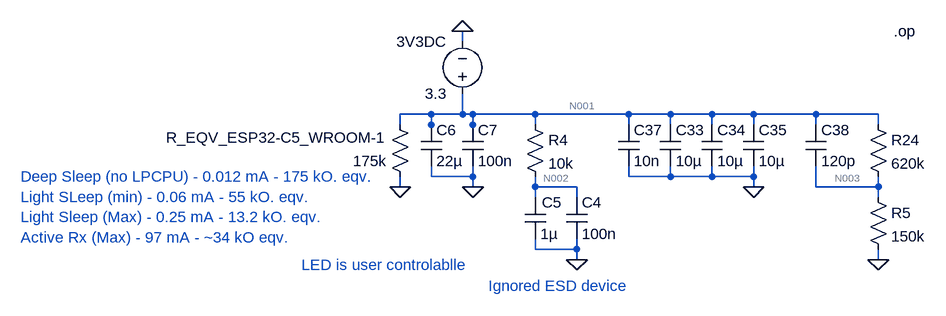
[diagram p0: schematic ESP32C5_DFR1222v1.0_FireBeetle2IoT_LTSpice.asc]
ESP32C5_DFR1222v1.0_FireBeetle2IoT_LTSpice.asc, the LTspice schematic file:
Version 4.1
SHEET 1 880 680
WIRE 144 48 144 32
WIRE 96 160 48 160
WIRE 144 160 144 128
WIRE 144 160 96 160
WIRE 160 160 144 160
WIRE 256 160 160 160
WIRE 400 160 256 160
WIRE 464 160 400 160
WIRE 528 160 464 160
WIRE 592 160 528 160
WIRE 688 160 592 160
WIRE 784 160 688 160
WIRE 48 176 48 160
WIRE 96 176 96 160
WIRE 160 176 160 160
WIRE 256 176 256 160
WIRE 400 176 400 160
WIRE 464 176 464 160
WIRE 528 176 528 160
WIRE 592 176 592 160
WIRE 688 176 688 160
WIRE 784 176 784 160
WIRE 96 192 96 176
WIRE 160 192 160 176
WIRE 96 256 96 240
WIRE 160 256 160 240
WIRE 160 256 96 256
WIRE 400 256 400 240
WIRE 464 256 464 240
WIRE 464 256 400 256
WIRE 528 256 528 240
WIRE 528 256 464 256
WIRE 592 256 592 240
WIRE 592 256 528 256
WIRE 48 272 48 256
WIRE 160 272 160 256
WIRE 256 272 256 256
WIRE 320 272 256 272
WIRE 592 272 592 256
WIRE 688 272 688 240
WIRE 784 272 784 256
WIRE 784 272 688 272
WIRE 256 288 256 272
WIRE 320 288 320 272
WIRE 784 288 784 272
WIRE 256 368 256 352
WIRE 320 368 320 352
WIRE 320 368 256 368
WIRE 320 384 320 368
WIRE 784 384 784 368
FLAG 144 32 0
FLAG 48 272 0
FLAG 160 272 0
FLAG 320 384 0
FLAG 592 272 0
FLAG 784 384 0
SYMBOL voltage 144 144 R180
WINDOW 0 24 96 Left 2
WINDOW 3 24 16 Left 2
SYMATTR InstName 3V3DC
SYMATTR Value 3.3
SYMBOL res 64 272 R180
WINDOW 0 36 76 Left 2
WINDOW 3 36 40 Left 2
SYMATTR InstName R_EQV_ESP32-C5_WROOM-1
SYMATTR Value 175k
SYMBOL cap 80 176 R0
SYMATTR InstName C6
SYMATTR Value 22µ
SYMBOL cap 144 176 R0
SYMATTR InstName C7
SYMATTR Value 100n
SYMBOL res 240 160 R0
SYMATTR InstName R4
SYMATTR Value 10k
SYMBOL cap 240 288 R0
WINDOW 0 26 8 Left 2
SYMATTR InstName C5
SYMATTR Value 1µ
SYMBOL cap 304 288 R0
SYMATTR InstName C4
SYMATTR Value 100n
SYMBOL cap 384 176 R0
SYMATTR InstName C37
SYMATTR Value 10n
SYMBOL cap 448 176 R0
SYMATTR InstName C33
SYMATTR Value 10µ
SYMBOL cap 512 176 R0
SYMATTR InstName C34
SYMATTR Value 10µ
SYMBOL cap 576 176 R0
SYMATTR InstName C35
SYMATTR Value 10µ
SYMBOL cap 672 176 R0
SYMATTR InstName C38
SYMATTR Value 120p
SYMBOL res 768 160 R0
SYMATTR InstName R24
SYMATTR Value 620k
SYMBOL res 768 272 R0
SYMATTR InstName R5
SYMATTR Value 150k
TEXT -536 256 Left 2 ;Deep Sleep (no LPCPU) - 0.012 mA - 175 kO. eqv.\nLight SLeep (min) - 0.06 mA - 55 kO. eqv.\nLight Sleep (Max) - 0.25 mA - 13.2 kO. eqv.\nActive Rx (Max) - 97 mA - ~34 kO eqv.
TEXT 184 424 Left 2 ;Ignored ESD device
TEXT -104 392 Left 2 ;LED is user controlablle
TEXT 808 32 Left 2 !.op

The netlist it stands for:
* ESP32C5_DFR1222v1.0_FireBeetle2IoT_LTSpice.asc
V§3V3DC N001 0 3.3
R_EQV_ESP32-C5_WROOM-1 0 N001 175k
C6 N001 0 22µ
C7 N001 0 100n
R4 N001 N002 10k
C5 N002 0 1µ
C4 N002 0 100n
C37 N001 0 10n
C33 N001 0 10µ
C34 N001 0 10µ
C35 N001 0 10µ
C38 N001 N003 120p
R24 N001 N003 620k
R5 N003 0 150k
* Deep Sleep (no LPCPU) - 0.012 mA - 175 kO. eqv.
* Light SLeep (min) - 0.06 mA - 55 kO. eqv.
* Light Sleep (Max) - 0.25 mA - 13.2 kO. eqv.
* Active Rx (Max) - 97 mA - ~34 kO eqv.
* Ignored ESD device
* LED is user controlablle
.op
.backanno
.end

* Results of the author's LTspice run, read from the files saved beside the schematic
* Operating Point:
*   V(n001) = 3.3 V
*   V(n002) = 3.3 V
*   V(n003) = 642.9 mV
*   I(3V3DC) = -23.14 µA
*   I(C33) = 0 A
*   I(C34) = 0 A
*   I(C35) = 0 A
*   I(C37) = 0 A
*   I(C38) = 0 A
*   I(C4) = 0 A
*   I(C5) = 0 A
*   I(C6) = 0 A
*   I(C7) = 0 A
*   I(R24) = 4.286 µA
*   I(R4) = 0 A
*   I(R5) = 4.286 µA
*   I(R_EQV_ESP32-C5_WROOM-1) = -18.86 µA